# EAGLE design rpiz (EAGLE 8.0.1)
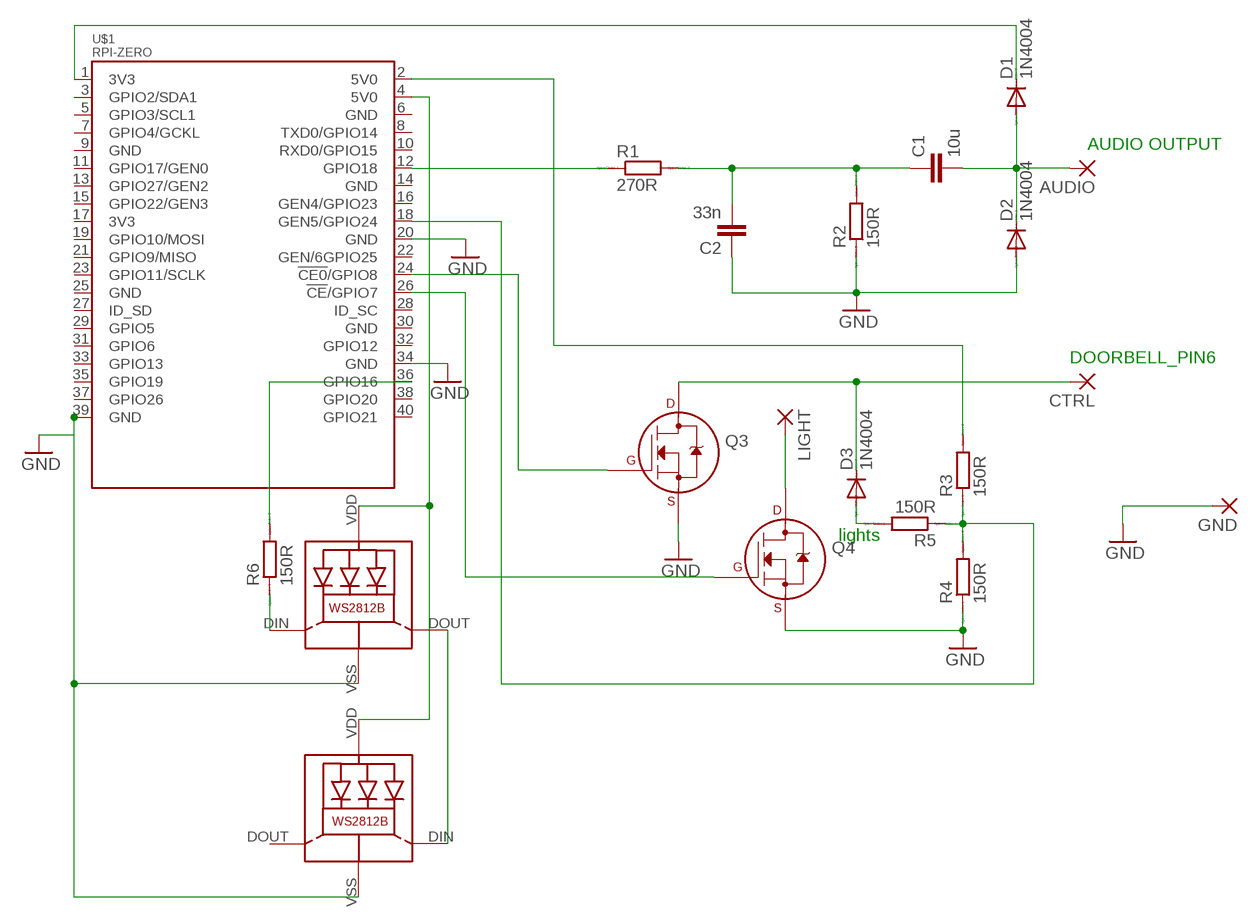
[diagram p0: schematic, sheet 1]

## Parts
AUDIO  2,15/1,0  [2,15/1,0]
C1  10u  C5/3  [C5B3]
C2  33n  C5/3  [C5B3]
CTRL  2,15/1,0  [2,15/1,0]
D1  1N4004  [DO41-10]
D2  1N4004  [DO41-10]
D3  1N4004  [DO41-10]
GND  2,15/1,0  [2,15/1,0]
LED1  WS2812B  [WS2812B]
LED2  WS2812B  [WS2812B]
LIGHT  2,15/1,0  [2,15/1,0]
Q3  2N7000_TO92  [TO-92]
Q4  2N7000_TO92  [TO-92]
R1  270R  R0204/7  [0204/7]
R2  150R  R0204/7  [0204/7]
R3  150R  R0204/7  [0204/7]
R4  150R  R0204/7  [0204/7]
R5  150R  R0204/7  [0204/7]
R6  150R  R0204/7  [0204/7]
U$1  RPI-ZERO  [RASPBERRYPI_BASTELSTUBE_V13_RASPI_BOARD_B+_FULL]

## Nets
3V3@1: D1.C U$1.1(3V3)
5V0@1: R3.2 U$1.2(5V0)
5V0@2: LED1.VDD LED2.VDD U$1.4(5V0)
AUDIO_OUT1: AUDIO.1(P) C1.2 D1.A D2.C
GND: C2.1 D2.A GND.1(P) LED1.VSS(GND) LED2.VSS(GND) Q3.1(S) Q4.1(S) R2.1 R4.1 U$1.20(GND) U$1.34(GND) U$1.39(GND)
N$1: C1.1 C2.2 R1.2 R2.2
N$2: CTRL.1(P) D3.C Q3.3(D)
N$3: Q3.2(G) U$1.24(!CE0!/GPIO8)
N$4: R1.1 U$1.12(GPIO18)
N$5: R3.1 R4.2 R5.1 U$1.18(GEN5/GPIO24)
N$6: D3.A R5.2
N$7: Q4.2(G) U$1.26(!CE!/GPIO7)
N$8: LED1.DIN(DI) R6.1
N$9: LIGHT.1(P) Q4.3(D)
N$10: R6.2 U$1.36(GPIO16)
N$11: LED1.DOUT(DO) LED2.DIN(DI)
Unconnected: LED2.DOUT(DO) U$1.3(GPIO2/SDA1) U$1.5(GPIO3/SCL1) U$1.6(GND) U$1.7(GPIO4/GCKL) U$1.8(TXD0/GPIO14) U$1.9(GND) U$1.10(RXD0/GPIO15) U$1.11(GPIO17/GEN0) U$1.13(GPIO27/GEN2) U$1.14(GND) U$1.15(GPIO22/GEN3) U$1.16(GEN4/GPIO23) U$1.17(3V3) U$1.19(GPIO10/MOSI) U$1.21(GPIO9/MISO) U$1.22(GEN/6GPIO25) U$1.23(GPIO11/SCLK) U$1.25(GND) U$1.27(ID_SD) U$1.28(ID_SC) U$1.29(GPIO5) U$1.30(GND) U$1.31(GPIO6) U$1.32(GPIO12) U$1.33(GPIO13) U$1.35(GPIO19) U$1.37(GPIO26) U$1.38(GPIO20) U$1.40(GPIO21)

## Notes on the sheet
- AUDIO OUTPUT
- DOORBELL_PIN6
- lights

## Library data of the parts
AUDIO CTRL GND LIGHT = wirepad:2,15/1,0: THROUGH-HOLE PAD
C1 C2 = capacitor-wima:C: CAPACITOR naming: grid - package width
D1-D3 = diode:1N4004: DIODE general purpose rectifier, 1 A
LED1 LED2 = WS2812B:WS2812B: Features and Benefits  * Intelligent reverse connect protection, the power supply reverse connection does not damage the IC. * The control circuit and the LED share the only power source. Control circuit and RGB chip are integrated in a package of 5050 components, form a complete control of pixel point.  * Built-in signal reshaping circuit, after wave reshaping to the next driver, ensure wave-form distortion not accumulate.  * Built-in electric reset circuit and power lost reset circuit.  * Each pixel of the three primary color can achieve 256 brightness display, completed 16777216 color full color display, and scan frequency not less than 400Hz/s.  * Cascading port transmission signal by single line.  * Any two point the distance more than 5m transmission signal without any increase circuit.  * When the refresh rate is 30fps, cascade number are not less than1024 points.  * Send data at speeds of 800Kbps.  *The color of the light were highly consistent, cost-effective. Applications  Full-color module, Full color soft lights a lamp strip. LED decorative lighting, Indoor/outdoor LED video irregular screen. General description WS2812B is a intelligent control LED light source that the control circuit and RGB chip are integrated in a package of 5050 components. It internal include intelligent digital port data latch and signal reshaping amplification drive circuit. Also include a precision internal oscillator and a 12V voltage programmable constant curre-nt control part, effectively ensuring the pixel point light color height consistent. The data transfer protocol use single NZR communication mode. After the pixel power-on reset, the DIN port receive data from controller, the first pixel collect initial 24bit data then sent to the internal data latch, the other data which reshaping by the internal signal reshaping amplification circuit sent to the next cascade pixel through the DO port. After transmission for each pixel,the signal to reduce 24bit. pixel adopt auto reshaping transmit technology, making the pixel cascade number is not limited the signal transmission, only depend on the speed of signal transmission. LED with low driving voltage, environmental protection and energy saving, high brightness, scattering angle is large, good consistency, low power, long life and other advantages. The control chip integrated in LED above becoming more simple circuit, small volume, convenient installation. Absolute Maximum Ratings Power supply voltage: VDD +3.5V..+5.3V Input voltage: VI -0.5V..VDD+0.5V based on WS2812 from https://github.com/adafruit/Adafruit-Eagle-Library
Q3 Q4 = transistors:2N700*: 2N7000, 2N7002, NDS7002A N-channel enhancement mode MOSFET
R1 = eagle-ltspice:R: RESISTOR, European symbol; SPICEMODEL: NONE; SPICEPREFIX: R
R2-R6 = eagle-ltspice:R: RESISTOR, European symbol; SPICEMODEL: NONE; SPICEPREFIX: 150R
U$1 = RPI-Zero:RPI-ZERO

## Board
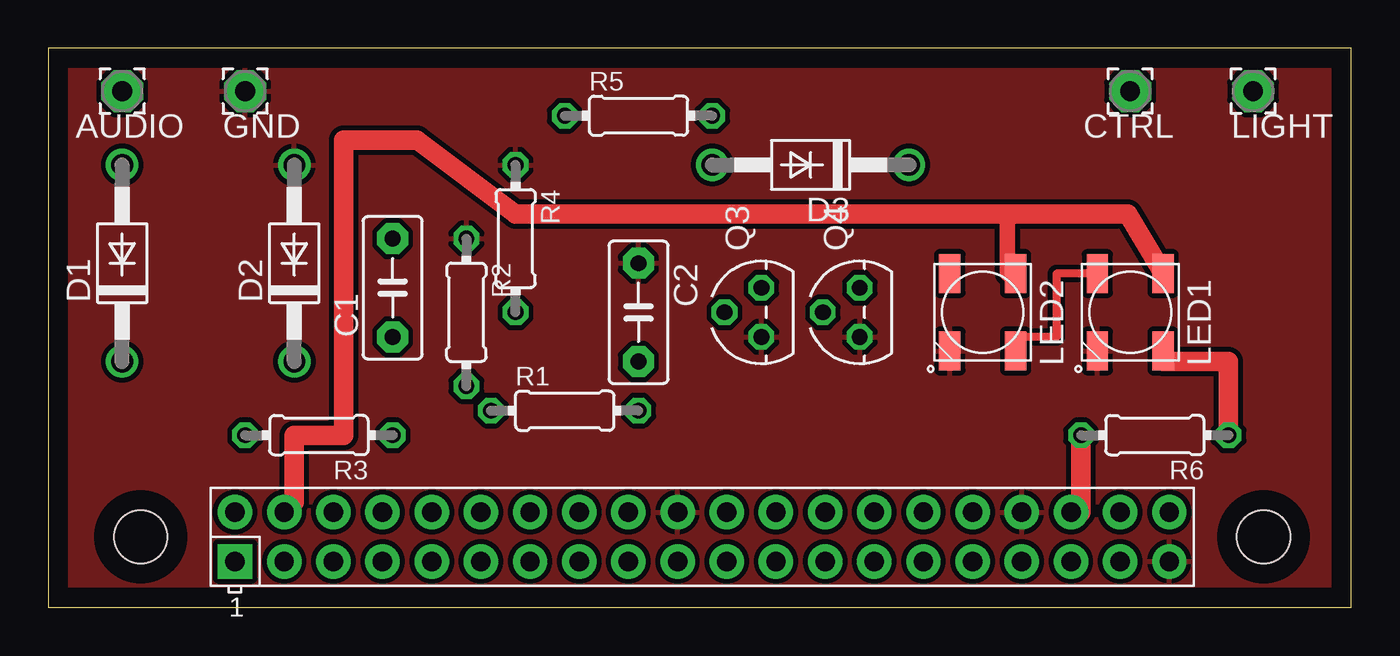
[diagram p1: board, top side]
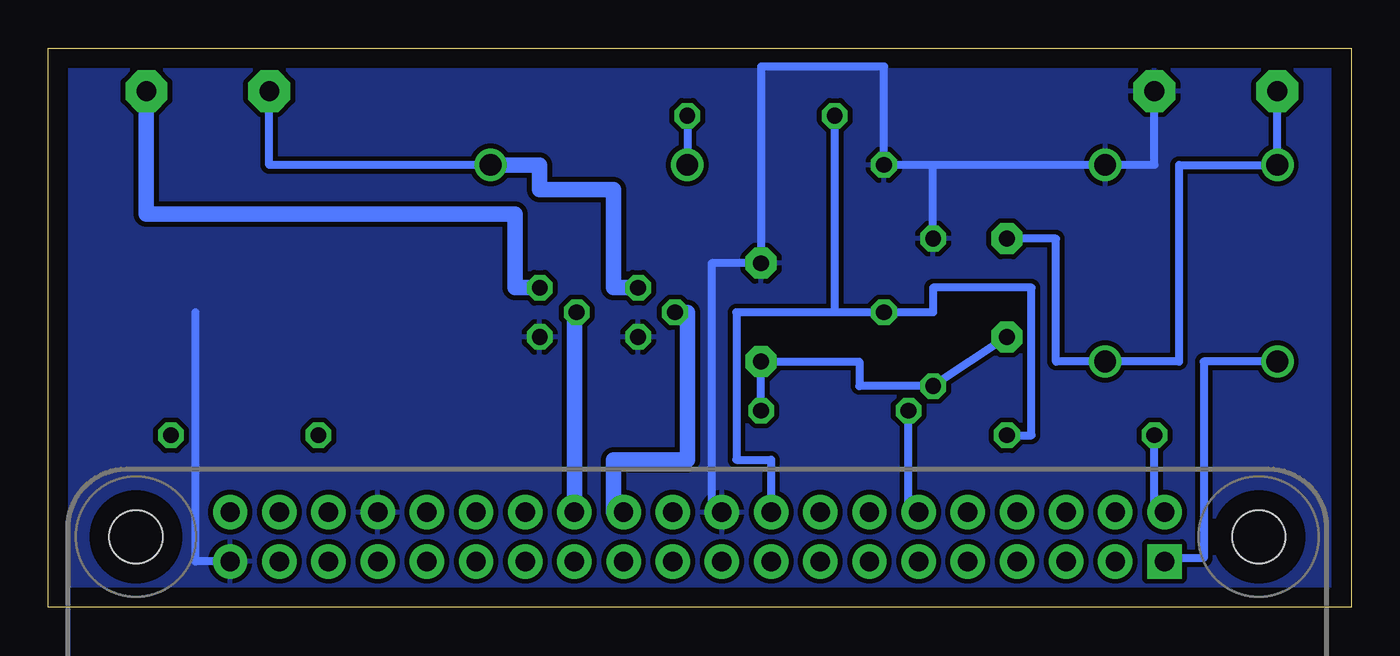
[diagram p2: board, bottom side, seen from below]

Size 67.29 x 28.88 mm. Coordinates in mm from the lower left corner, seen from the top.
Outline: 0,0 67.29,0 67.29,28.88 0,28.88 0,0
Copper layers (1*16): Top 0.035mm / dielectric 1.5mm / Bottom 0.035mm
Design rules "default": minimum track width 10mil, minimum drill 24mil, track to track 8mil, track to pad 8mil, pad to pad 8mil, via to via 8mil, smd to smd 8mil, copper to edge 40mil, drill to drill 8mil, minimum pad ring 10mil, minimum via ring 8mil, stop-mask expansion 4mil, vias tented up to drill 0mil, thermal gap 10mil

### Footprints (pad centres in the part's own frame; a part is rotated, then mirrored left to right if it is on the bottom)
2,15/1,0 = drill 1.016 pad 2.159 octagon: 1 0,0
C5B3 = drill 0.813 pad 1.6 octagon: 1 -2.54,0; 2 2.54,0
DO41-10 = drill 1.118: A 5.08,0; C -5.08,0
WS2812B = smd 2 x 1.1: DIN 2,1.7; DOUT -2,-1.7; VDD -2,1.7; VSS 2,-1.7
TO-92 = drill 0.813 octagon: 1 -1.27,0; 2 0,1.905; 3 1.27,0
0204/7 = drill 0.813 octagon: 1 -3.81,0; 2 3.81,0
RASPBERRYPI_BASTELSTUBE_V13_RASPI_BOARD_B+_FULL = drill 1 pad 1.778 square: 1 8.37,25.23 | drill 1 pad 1.778: 2 8.37,27.77; 3 10.91,25.23; 4 10.91,27.77; 5 13.45,25.23; 6 13.45,27.77; 7 15.99,25.23; 8 15.99,27.77; 9 18.53,25.23; 10 18.53,27.77; 11 21.07,25.23; 12 21.07,27.77; 13 23.61,25.23; 14 23.61,27.77; 15 26.15,25.23; 16 26.15,27.77; 17 28.69,25.23; 18 28.69,27.77; 19 31.23,25.23; 20 31.23,27.77; 21 33.77,25.23; 22 33.77,27.77; 23 36.31,25.23; 24 36.31,27.77; 25 38.85,25.23; 26 38.85,27.77; 27 41.39,25.23; 28 41.39,27.77; 29 43.93,25.23; 30 43.93,27.77; 31 46.47,25.23; 32 46.47,27.77; 33 49.01,25.23; 34 49.01,27.77; 35 51.55,25.23; 36 51.55,27.77; 37 54.09,25.23; 38 54.09,27.77; 39 56.63,25.23; 40 56.63,27.77 | hole 2.75: 3.5,26.5; 61.5,26.5

### Placement (x,y rotation side)
AUDIO  3.81,26.67 0 top
C1  17.78,16.51 90 top
C2  30.48,15.24 270 top
CTRL  55.88,26.67 0 top
D1  3.81,17.78 90 top
D2  12.7,17.78 90 top
D3  39.37,22.86 180 top
GND  10.16,26.67 0 top
LED1  55.88,15.24 270 top
LED2  48.26,15.24 270 top
LIGHT  62.23,26.67 0 top
Q3  36.83,15.24 90 top
Q4  41.91,15.24 90 top
R1  26.67,10.16 0 top
R2  21.59,15.24 270 top
R3  13.97,8.89 180 top
R4  24.13,19.05 270 top
R5  30.48,25.4 0 top
R6  57.15,8.89 180 top
U$1  1.27,-22.86 0 top

### Tracks (layer width: path | path; a pad name or v marks a point on that pad's centre or on a via)
3V3@1
  Bottom 0.406: D1.C 7.62,12.7 7.62,2.54 9.64,2.54 U$1.1
5V0@1
  Bottom 0.406: U$1.2 10.16,4.91 R3.2
5V0@2
  Top 0.813: LED2.VDD 49.53,17.24 49.53,20.32
  Top 1.016: LED1.VDD 55.77,20.32 49.53,20.32 24.13,20.32 19.05,24.13 15.24,24.13 15.24,8.89 12.7,8.89 12.7,5.43 U$1.4
AUDIO_OUT1
  Bottom 0.406: C1.2 15.24,19.05 15.24,12.7 D2.C 8.89,12.7 8.89,22.86 D1.A AUDIO.1
GND
  Bottom 0.406: GND.1 10.16,22.86 D2.A 21.59,22.86 | 57.9,2.54 U$1.39 59.69,2.37 59.69,15.24 | U$1.20 33.02,4.91 33.02,17.78 C2.1 30.48,27.94 24.13,27.94 R4.1 21.59,22.86 | R2.1 21.59,22.86
  pour Bottom (isolate 0.254): 0,29.21 67.31,29.21 67.31,0 0,0
  pour Top (isolate 0.254): 0,29.21 67.31,29.21 67.31,0 0,0
N$1
  Bottom 0.406: R1.2 C2.2 25.4,12.7 25.4,11.43 R2.2 C1.1
N$2
  Bottom 0.406: D3.C 55.88,22.86 CTRL.1
  Bottom 0.813: Q3.3 38.1,16.51 38.1,21.59 41.91,21.59 41.91,22.86 D3.C
N$3
  Bottom 0.406: 38.1,4.91 U$1.24
  Bottom 0.813: Q3.2 34.29,15.24 34.29,7.62 38.1,7.62 38.1,4.91
N$4
  Bottom 0.406: U$1.12 22.86,4.91 R1.1
N$5
  Bottom 0.406: R4.2 31.75,15.24 31.75,7.62 29.96,7.62 U$1.18 | R4.2 26.67,15.24 R5.1 | R3.1 16.51,8.89 16.51,16.51 21.59,16.51 21.59,15.24 R4.2
N$6
  Bottom 0.406: R5.2 D3.A
N$7
  Bottom 0.406: U$1.26 40.64,4.91
  Bottom 0.813: Q4.2 40.12,15.24 U$1.26
N$8
  Top 1.016: R6.1 60.96,12.7 57.58,12.7 LED1.DIN
N$9
  Bottom 0.813: Q4.3 43.18,16.51 43.18,20.32 62.23,20.32 LIGHT.1
N$10
  Top 1.016: U$1.36 53.34,4.91 R6.2
N$11
  Top 0.406: LED1.DOUT 52.07,17.24 52.07,13.97 49.96,13.97 LED2.DIN

### Text on the board
tPlace: ▄██████████████▄▐█▄▄▄▄█▌ / ██████▌▄▌▄▐▐▌███▌▀▀██▀▀ / ████▄█▌▄▌▄▐▐▌▀███▄▄█▌ / ▄▄▄▄▄██████████████▀